# Altium schematic sheet Power Regulation and Protection.SCHDOC
size A4
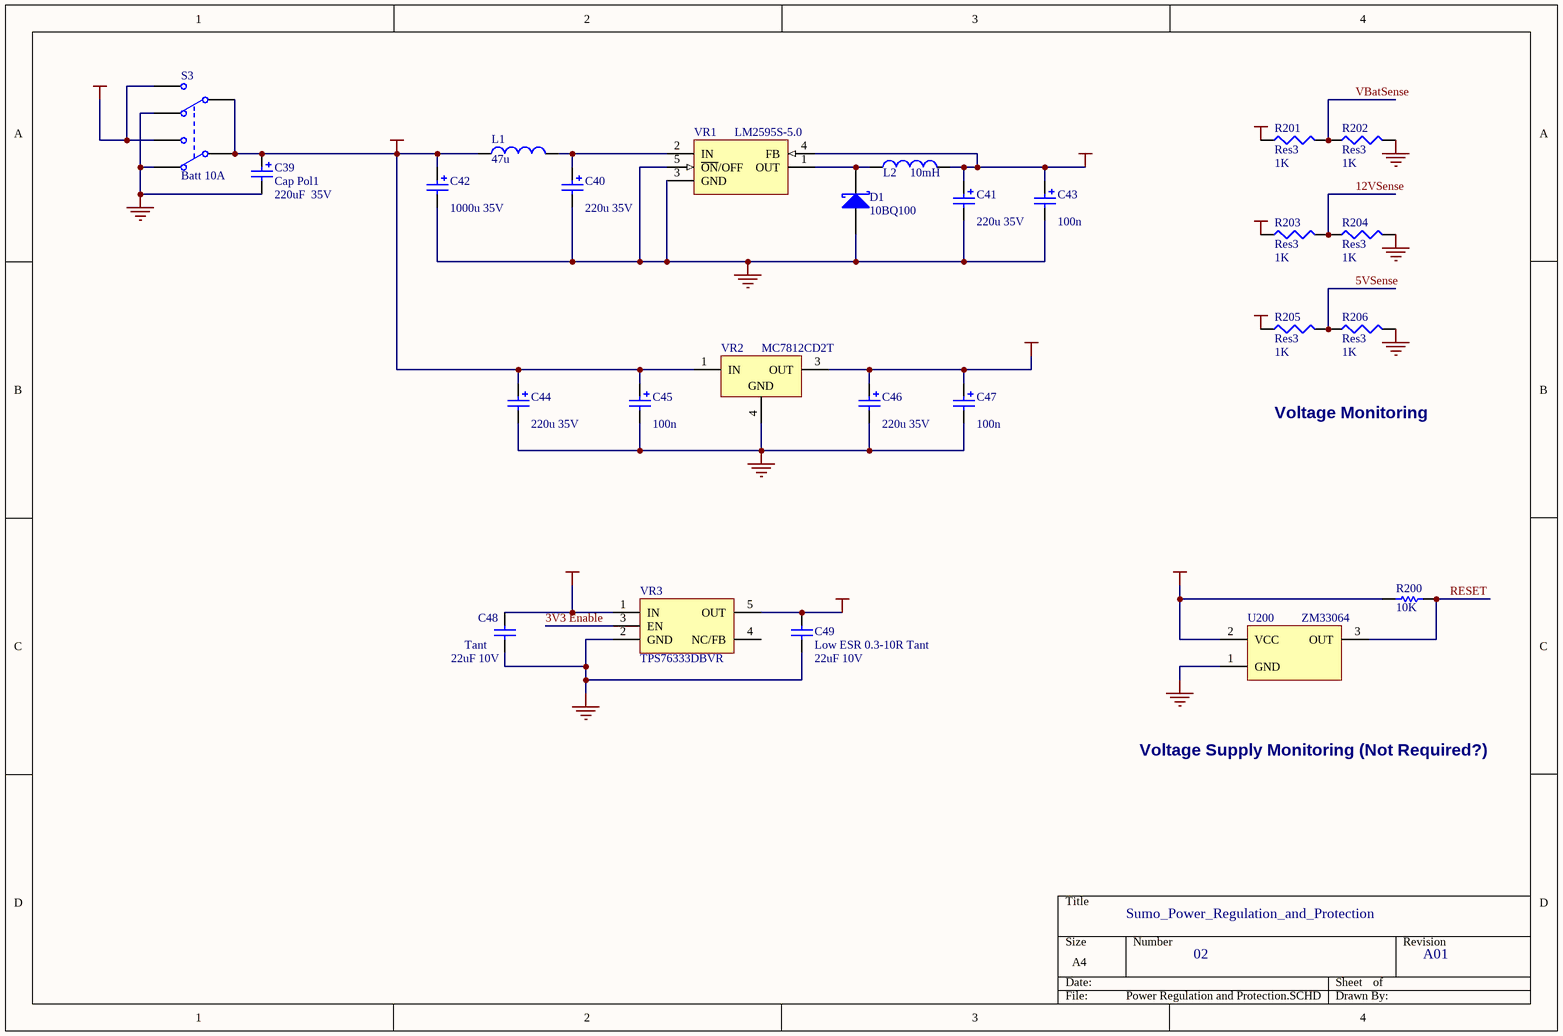
[diagram p0: Power Regulation and Protection.SCHDOC]

## Parts
C39  Cap Pol1  value 220uF  35V  [CAPPOL5-10X13]
C40  value 220u 35V  [CAPPOL5-10X13]  (hidden comment: Cap Pol1)
C41  value 220u 35V  [CAPPOL5-10X13]  (hidden comment: Cap Pol1)
C42  value 1000u 35V  [CAPPOL7.5-16]  (hidden comment: Cap Pol1)
C43  value 100n  [CC2012-0805]  (hidden comment: Cap Pol3)
C44  value 220u 35V  [CAPPOL5-10X13]  (hidden comment: Cap Pol1)
C45  value 100n  [CC2012-0805]  (hidden comment: Cap Pol3)
C46  value 220u 35V  [CAPPOL5-10X13]  (hidden comment: Cap Pol1)
C47  value 100n  [CC2012-0805]  (hidden comment: Cap Pol3)
C48  Tant  value 22uF 10V  [CC4532-1812]
C49  Low ESR 0.3-10R Tant  value 22uF 10V  [CC4532-1812]
D1  10BQ100  [SMB]
L1  value 47u  [C1005-0402]  (hidden comment: Inductor)
L2  value 10mH  [C1005-0402]  (hidden comment: Inductor)
R200  10K  [R2012-0805]
R201  Res3  value 1K  [R2012-0805]
R202  Res3  value 1K  [R2012-0805]
R203  Res3  value 1K  [R2012-0805]
R204  Res3  value 1K  [R2012-0805]
R205  Res3  value 1K  [R2012-0805]
R206  Res3  value 1K  [R2012-0805]
S3  Batt 10A  [SW  DPDT]
U200  ZM33064  [BCY-W3]
VR1  LM2595S-5.0  [TO-263 5 Pin SMT]
VR2  MC7812CD2T  [936-03]
VR3  TPS76333DBVR  [SOT-23-5]

## Nets
3V3: C49.2 VR3.5(OUT)
5V: C41.1 C43.1 C48.2 L2.2 R200.2 R205.1 U200.2(VCC) VR1.4(FB) VR3.1(IN)
12V: C46.1 C47.1 R203.1 VR2.3(OUT)
GND: C39.2 C40.2 C41.2 C42.2 C43.2 C44.2 C45.2 C46.2 C47.2 C48.1 C49.1 D1.1(A) R202.2 R204.2 R206.2 S3.1(NC1) S3.4(NC2) U200.1(GND) VR1.3(GND) VR1.5(~{ON}/OFF) VR2.4(GND) VR3.2(GND)
VBat: C39.1 C42.1 C44.1 C45.1 L1.1 R201.1 S3.2(COMMON1) S3.5(COMMON2) VR2.1(IN)
VBatIn: S3.3(NO1) S3.6(NO2)
3V3 Enable: VR3.3(EN)
5VSense: R205.2 R206.1
12VSense: R203.2 R204.1
RESET: R200.1 U200.3(OUT)
VBatSense: R201.2 R202.1
NetC40_1: C40.1 L1.2 VR1.2(IN)
NetD1_2: D1.2(K) L2.1 VR1.1(OUT)

Not connected (* = marked no-connect by the designer): VR3 4(NC/FB)

## Notes on the sheet
- Voltage Monitoring
- Voltage Supply Monitoring (Not Required?)
- Sumo_Power_Regulation_and_Protection
- 02
- A01

## Library data of the parts
C39-C42 C44 C46 = Cap Pol1: Polarized Capacitor (Radial); Published: 8-Jun-2000; Revision: July-2002: Re-released for DXP Platform.; Publisher: Altium Limited
C43 C45 C47 = Cap Pol3: Polarized Capacitor (Surface Mount); Published: 8-Jun-2000; Revision: July-2002: Re-released for DXP Platform.; Publisher: Altium Limited
C48 C49 = Cap Semi: Capacitor (Semiconductor SIM Model); Published: 8-Jun-2000; Revision: July-2002: Re-released for DXP Platform.; Publisher: Altium Limited
D1 = 10BQ100: Schottky Rectifier; Revision 1: 10-Jul-2000: SIM Model Added.; Revision 2: 17-Jul-2002: Re-released for DXP Platform.; Published: 8-Jun-2000; Datasheet: Latest Revision: PD-2.437A; Package Reference: SMB; Publisher: Altium Limited
R200 = Res1: Resistor; Published: 8-Jun-2000; Revision: July-2002: Re-released for DXP Platform.; Publisher: Altium Limited
R201-R206 = Res3: Resistor; Published: 8-Jun-2000; Revision: July-2002: Re-released for DXP Platform.; Publisher: Altium Limited
S3 = SW DPDT: Switch; Published: 24-Mar-1999; Revision: July-2002: Re-released for DXP Platform.; Publisher: Altium Limited
U200 = ZM33064: Generic 5V Supply Voltage Monitor
VR1 = LM2595S-5.0: Simple Switcher Power Converter 150 kHz 1A Step Down Voltage Regulator; Note: Tab is connected to GND; Published: 15-Apr-2002; Datasheet: Latest Revision: May-1999; Package Reference: TS5B; Publisher: Altium Limited
VR2 = MC7812CD2T: Three-Terminal Positive Voltage Regulator; Package Information: Latest Revision: 1997; Note: Pin 2 is electrically connected to Pin 4; Pin 2 is trimmed and not drawn;; Published: 15-Apr-2002; Datasheet: Latest Revision: 1997; Package Reference: 936-03; Publisher: Altium Limited
L1 L2 = Inductor: Published: 8-Jun-2000; Revision: July-2002: Re-released for DXP Platform.; Publisher: Altium Limited